# Altium schematic sheet PDU.SchDoc
size 279 x 215 mm; SheetNumber: 2; SheetTotal: 5
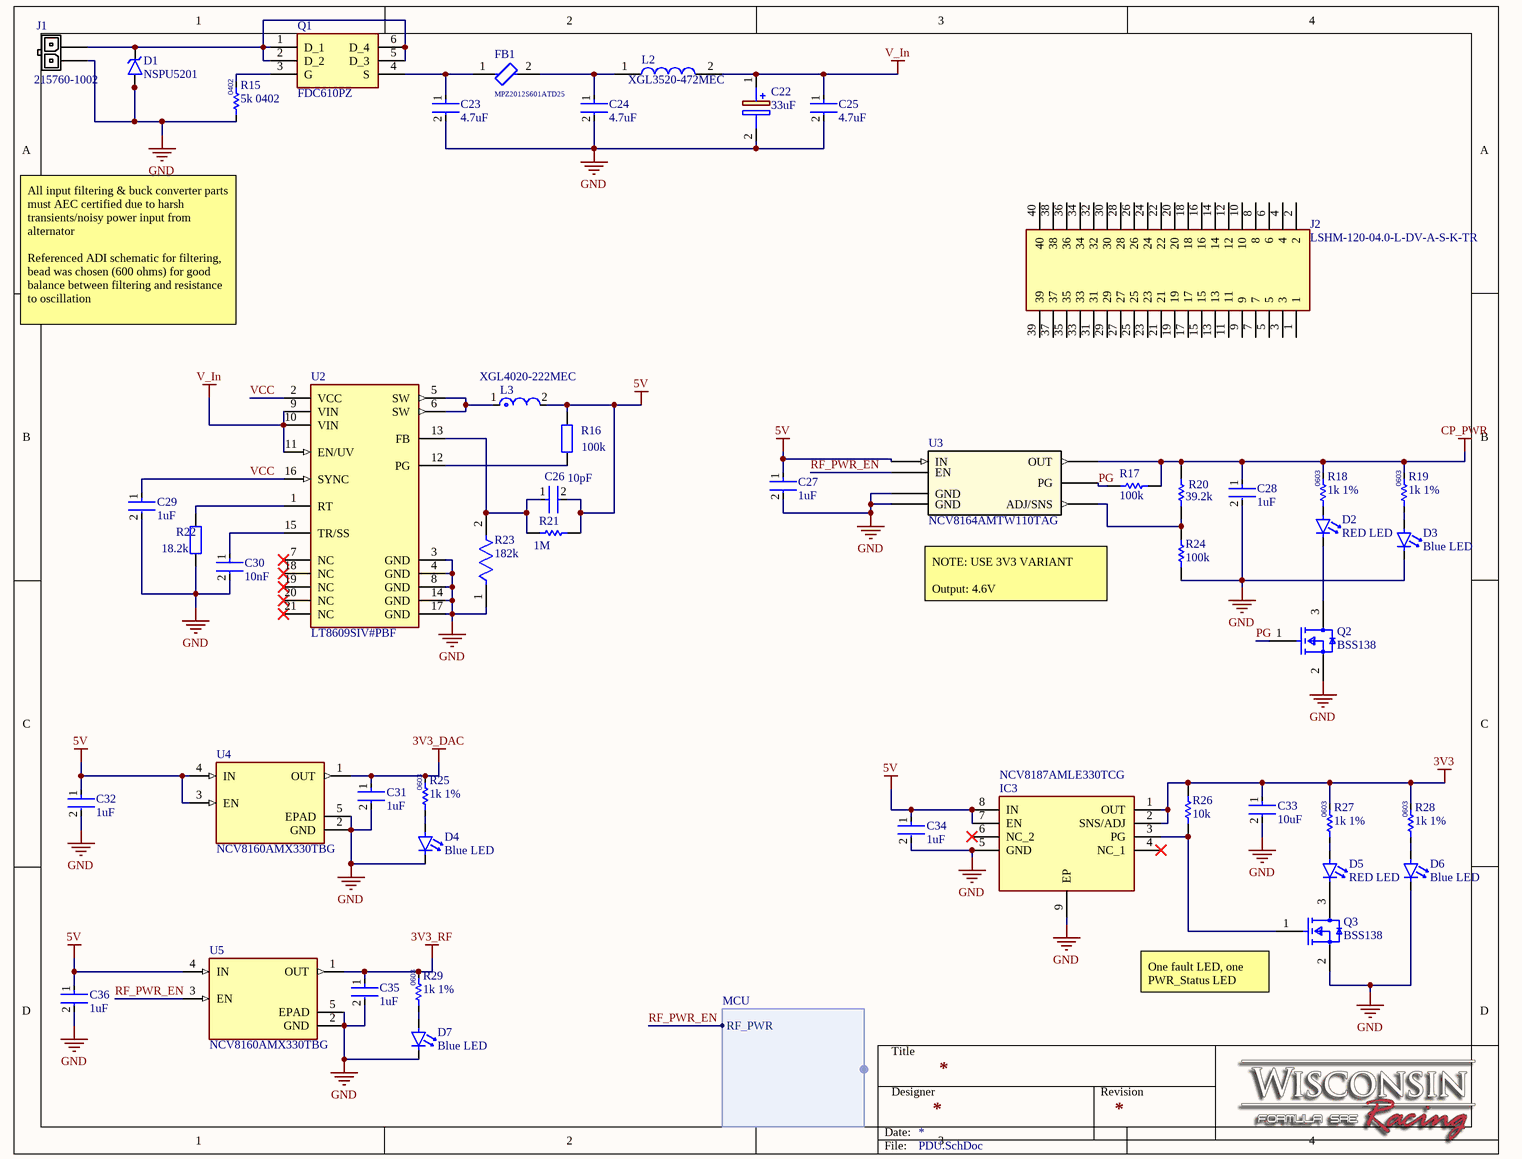
[diagram p0: PDU.SchDoc]

## Parts
C22  33uF  [MAL215097904E3]
C23  4.7uF  [FP-CGA4J-IPC_C]
C24  4.7uF  [FP-CGA4J-IPC_C]
C25  4.7uF  [FP-CGA4J-IPC_C]
C26  10pF  [FP-GCM155-0_05-IPC_C]
C27  1uF  [FP-GRM155-0_1-IPC_C]
C28  1uF  [FP-GRM155-0_1-IPC_C]
C29  1uF  [FP-GRT155-0_1-IPC_A]
C30  10nF  [FP-GCM155-0_05-IPC_C]
C31  1uF  [FP-GRM155-0_1-IPC_C]
C32  1uF  [FP-GRM155-0_1-IPC_C]
C33  10uF  [FP-GRM155-0_2-IPC_A]
C34  1uF  [FP-GRM155-0_1-IPC_C]
C35  1uF  [FP-GRM155-0_1-IPC_C]
C36  1uF  [FP-GRM155-0_1-IPC_C]
D1  NSPU5201  [NSPM5131MUTBG]
D2  RED LED  [DIOC1608X05N]
D3  Blue LED  [0603-LED-1]
D4  Blue LED  [0603-LED-1]
D5  RED LED  [DIOC1608X05N]
D6  Blue LED  [0603-LED-1]
D7  Blue LED  [0603-LED-1]
FB1  MPZ2012S601ATD25  [BEADC2012X105N]
IC3  NCV8187AMLE330TCG  [SON65P300X300X100-9N-D]
J1  215760-1002  [215760-1002-Footprint-1]
J2  LSHM-120-04.0-L-DV-A-S-K-TR  [LSHM-120-XX.X-YYY-DV-A-S-K-TR]
L2  XGL3520-472MEC  [XGL3520472MEC]
L3  XGL4020-222MEC  [FP-XGL4020-MFG]
Q1  FDC610PZ  [SOT95P280X110-6N]
Q2  BSS138  [FP-318-08-IPC_B]
Q3  BSS138  [FP-318-08-IPC_B]
R15  5k 0402  [Res0402-Type-1]
R16  100k  [WRIS-RSKS_0402]
R17  100k  [RESC1005X40X25NL05T10]
R18  1k 1%  [Res0603-type-1]
R19  1k 1%  [Res0603-type-1]
R20  39.2k  [RESC1005X40X25ML05T10]
R21  1M  [RESC1005X40X25NL05T10]
R22  18.2k  [WRIS-RSKS_0402]
R23  182k  [FP-AC0402-IPC_C]
R24  100k  [RESC1005X40X25NL05T10]
R25  1k 1%  [Res0603-type-1]
R26  10k  [RESC1005X40X25ML05T05]
R27  1k 1%  [Res0603-type-1]
R28  1k 1%  [Res0603-type-1]
R29  1k 1%  [Res0603-type-1]
U2  LT8609SIV#PBF  [FP-LQFN-16-05-08-1516-MFG]
U3  NCV8164AMTW110TAG  [WDFNW6_511DW_OSI]
U4  NCV8160AMX330TBG  [VREG_NCV8160AMX330TBG]
U5  NCV8160AMX330TBG  [VREG_NCV8160AMX330TBG]

## Harnesses
MCU: RF_PWR

## Nets
3V3: C33.1 IC3.1(OUT) IC3.2(SNS/ADJ) R26.2 R27.2 R28.2
3V3_DAC: C31.1 R25.2 U4.1(OUT)
3V3_RF: C35.1 R29.2 U5.1(OUT)
5V: C26.2 C27.1 C32.1 C34.1 C36.1 IC3.7(EN) IC3.8(IN) L3.2 R16.2 R21.2 U3.6(IN) U4.3(EN) U4.4(IN) U5.4(IN)
CP_PWR: C28.1 R17.1 R18.2 R19.2 R20.2 U3.1(OUT)
GND: C22.2(-) C23.2 C24.2 C25.2 C27.2 C28.2 C29.2 C30.2 C31.2 C32.2 C33.2 C34.2 C35.2 C36.2 D1.5(GND_(A)_1) D1.6(GND_(A)_2) D1.7(GND_(A)_3) D1.8(GND_(A)_4) D3.1(C) D4.1(C) D6.1(C) D7.1(C) IC3.5(GND) IC3.9(EP) J1.2 Q2.2(S) Q3.2(S) R15.1 R22.1 R23.1 R24.1 U2.3(GND) U2.4(GND) U2.8(GND) U2.14(GND) U2.17(GND) U3.5(GND) U3.7(GND) U4.2(GND) U4.5(EPAD) U5.2(GND) U5.5(EPAD)
V_In: C22.1(+) C25.1 L2.2 U2.9(VIN) U2.10(VIN) U2.11(EN/UV)
PG: Q2.1(G) R17.2 U3.3(PG)
RF_PWR_EN: U3.4(EN) U5.3(EN) ; harness MCU.RF_PWR
VCC: C29.1 U2.2(VCC) U2.16(SYNC)
NetC23_1: C23.1 FB1.1 Q1.4(S)
NetC24_1: C24.1 FB1.2 L2.1
NetC26_1: C26.1 R21.1 R23.2 U2.13(FB)
NetC30_1: C30.1 U2.15(TR/SS)
NetD1_1: D1.1 D1.2 J1.1 Q1.1(D_1) Q1.2(D_2) Q1.5(D_3) Q1.6(D_4)
NetD2_1: D2.1(C) Q2.3(D)
NetD3_2: D3.2(A) R19.1
NetD4_2: D4.2(A) R25.1
NetD5_1: D5.1(C) Q3.3(D)
NetD5_2: D5.2(A) R27.1
NetD6_2: D6.2(A) R28.1
NetD7_2: D7.2(A) R29.1
NetIC3_3: IC3.3(PG) Q3.1(G) R26.1
NetL3_1: L3.1 U2.5(SW) U2.6(SW)
NetQ1_3: Q1.3(G) R15.2
NetR16_1: R16.1 U2.12(PG)
NetR20_1: R20.1 R24.2 U3.2(ADJ/SNS)
NetR22_2: R22.2 U2.1(RT)

Not connected (* = marked no-connect by the designer): D2 2(A); IC3 4(NC_1)* 6(NC_2)*; J2 1 2 3 4 5 6 7 8 9 10 11 12 13 14 15 16 17 18 19 20 21 22 23 24 25 26 27 28 29 30 31 32 33 34 35 36 37 38 39 40; R18 1; U2 7(NC)* 18(NC)* 19(NC)* 20(NC)* 21(NC)*

## Notes on the sheet
- All input filtering & buck converter parts must AEC certified due to harsh transients/noisy power input from alternator
  Referenced ADI schematic for filtering, bead was chosen (600 ohms) for good balance between filtering and resistance to oscillation
- NOTE: USE 3V3 VARIANT
  Output: 4.6V
- (near Q3) One fault LED, one PWR_Status LED
- Title
- Designer
- Revision
- Date:
- File:
- (in symbol CMP-005-000017-1) 0603
- (in symbol CMP-Res-00031-1) 0402

## Library data of the parts
C22 = MAL215097904E3: Capacitor Polarised / MAL215097904E3; Manufacturer_Name: Vishay; Datasheet Link: https://www.vishay.com/docs/28395/150crz.pdf; Height: 10.5mm; Manufacturer_Part_Number: MAL215097904E3; Mouser Part Number: 594-MAL215097904E3; Mouser Price/Stock: https://www.mouser.co.uk/ProductDetail/Vishay-BC-Components/MAL215097904E3?qs=LPi%252B6n6Uj5NKbv7W8MBx6Q%3D%3D; Arrow Part Number: MAL215097904E3; Arrow Price/Stock: https://www.arrow.com/en/products/mal215097904e3/vishay?region=nac
C23-C25 = CMP-08246-000171-1: Cap Ceramic 4.7uF 50V X7R 10% Pad SMD 0805 +125°C Automotive T/R
C26 = CMP-06035-039712-1: Ceramic Capacitor for Automotive 10pF ±5% 50VDC C0G 0402 Paper T/R; Voltage Rating: 50V; Case/Package: 0402; Dielectric: C0G; Package Quantity: 10000; Ratings: AEC-Q200; Max Operating Temperature: 125°C; Width: 0.02inch; REACH SVHC: No SVHC; Mount: Surface Mount; Min Operating Temperature: -55°C; Lead Free: Lead Free; Packaging: Tape and Reel; Capacitance: 10pF; Case Code (Imperial): 0402; Tolerance: 5%; Height: 0.5mm; Thickness: 0.022inch; Length: 0.039inch; Case Code (Metric): 1005; Weight: 0.000212oz; Voltage Rating (DC): 50V; Termination: SMD/SMT
C27 C28 C31 C32 C34-C36 = CMP-06035-028020-1: Chip Multilayer Ceramic Capacitors for General Purpose, 0402, 1.0uF, X7R, 15%, 10%, 10V / GRM155Z71A105KE01D
C29 = CMP-06035-047663-1: Multi-Layer Ceramic Capacitor 1uF 25V X6S ±10% 0402 Paper T/R / GRT155C81E105KE13D
C30 = CMP-2008-03723-3: Ceramic Capacitor for Automotive 10nF ±10% 50VDC X7R 0402 Paper T/R / GCM155R71H103KA55D; Voltage Rating (DC): 50V; Min Operating Temperature: -55°C; Radiation Hardening: No; Mount: Surface Mount; Thickness: 0.022inch; Package Quantity: 1; Case Code (Imperial): 0402; Lead Free: Lead Free; Case/Package: 0402; Depth: 0.5mm; Termination: SMD/SMT; Tolerance: 10%; Voltage: 50V; Packaging: Tape and Reel; Width: 0.02inch; REACH SVHC: No SVHC; Height: 0.5mm; Max Operating Temperature: 125°C; Case Code (Metric): 1005; Voltage Rating: 50V; Capacitance: 10nF; Ratings: AEC-Q200; Length: 1mm; Dielectric: X7R
C33 = CMP-06035-061139-1: Chip Multilayer Ceramic Capacitors for General Purpose, 0402, 10uF, X5R, 15%, 20%, 6.3V
D1 = CMP-004-000061-2: Unidirectional High Voltage ESD and Surge Protection; Provides ESD Protection to IEC6100042 Level 4: +/-30 kV Contact Discharge; Small Package: 1.8 mm x 2.0 mm; These Devices are PbFree; Manufacturer_Name: onsemi; Arrow Part Number: NSPU5201MUTBG; Design Item ID: NSPU5201MUTBG; Source: SamacSys.SchLib; Mouser Price/Stock: https://www.mouser.co.uk/ProductDetail/ON-Semiconductor/NSPU5201MUTBG?qs=byeeYqUIh0OtIrNH4%2Fsnzg%3D%3D; Mouser Part Number: 863-NSPU5201MUTBG; Height: 0mm; Datasheet Link: https://www.onsemi.com/pub/Collateral/NSPU5201-D.PDF; Manufacturer_Part_Number: NSPU5201MUTBG; Arrow Price/Stock: https://www.arrow.com/en/products/nspu5201mutbg/on-semiconductor
D2 D5 = CMP-221-0013-1: 0603 Red SMD Led; Datasheet: https://www.aopled.com/AOP_PDFs/L196L-LIC.pdf
D3 D4 D6 D7 = CMP-LED-0000-10: Single Color LED, Blue, Water Clear, 1.1mm; Lens Color: Colorless; Wavelength: 468nm; Luminous Intensity: 180mcd; Number of Elements: 1; Power Dissipation: 76mW; Max Power Dissipation: 75mW; Forward Current: 20mA; Forward Voltage: 3.8V; Lens Style: Diffused,Colorless,Clear,Rectangular; Dominant Wavelength: 475nm; Viewing Angle: 130°; Reverse Voltage: 5V; Length: 0.8mm; Max Operating Temperature: 80°C; Height: 0.55mm; Mount: Surface Mount; Number of Pins: 2; Lens Transparency: Clear; Color: Blue; Radiation Hardening: No; Illumination Color: Blue; Depth: 1.6mm; Packaging: Tape and Reel; Case Code (Imperial): 0603; Number of LEDs: 1; Lead Free: Lead Free; Case Code (Metric): 1608; Width: 0.8mm; Min Operating Temperature: -20°C; Case/Package: 0603; Package Quantity: 1; Test Current: 20mA
FB1 = CMP-002-000016-2: Ferrite Beads Multi-Layer Power 600Ohm 25% 100MHz 2A 100mOhm DCR 0805 Automotive T/R; Manufacturer_Name: TDK; Arrow Part Number: MPZ2012S601ATD25; Datasheet Link: https://product.tdk.com/system/files/dam/doc/product/emc/emc/beads/catalog/beads_automotive_power_mpz2012_en.pdf; Manufacturer_Part_Number: MPZ2012S601ATD25; Design Item ID: MPZ2012S601ATD25; Height: 1.05mm; Mouser Price/Stock: https://www.mouser.co.uk/ProductDetail/TDK/MPZ2012S601ATD25?qs=n0%2F4YYxsltT7vo9AjVUU7w%3D%3D; Mouser Part Number: 810-MPZ2012S601ATD25; Source: SamacSys.SchLib; Arrow Price/Stock: https://www.arrow.com/en/products/mpz2012s601atd25/tdk.html?utm_currency=USD&region=europe
IC3 = NCV8187AMLE330TCG: Integrated Circuit; Manufacturer_Name: onsemi; Datasheet Link: https://www.onsemi.com/pub/Collateral/NCV8187-D.PDF; Height: 1mm; Manufacturer_Part_Number: NCV8187AMLE330TCG; Mouser Part Number: 863-CV8187AMLE330TCG; Mouser Price/Stock: https://www.mouser.co.uk/ProductDetail/onsemi/NCV8187AMLE330TCG?qs=HBWAp0VN4RhK8HbhfCLXcQ%3D%3D; Arrow Part Number: NCV8187AMLE330TCG; Arrow Price/Stock: https://www.arrow.com/en/products/ncv8187amle330tcg/on-semiconductor?region=nac
J1 = CMP-007-000050-6: Micro-Fit+ Right-Angle Header, 3.00mm Pitch, Single Row, 2 Circuits, Matte Tin (Sn) Plating, UL 94V-0, Glow-Wire Capable, Black; Manufacturer 1: Molex; Number of Contacts: 2; Manufacturer Part Number 1: 215760-1002; Number of Rows: 1
J2 = LSHM-120-04.0-L-DV-A-S-K-TR: Connector; Manufacturer_Name: SAMTEC; Datasheet Link: http://suddendocs.samtec.com/prints/lshm-1xx-xx.x-xxx-dv-a-x-x-xx-mkt.pdf; Manufacturer_Part_Number: LSHM-120-04.0-L-DV-A-S-K-TR; Mouser Part Number: 200-LSHM12004LDVASK; Mouser Price/Stock: https://www.mouser.co.uk/ProductDetail/Samtec/LSHM-120-040-L-DV-A-S-K-TR?qs=PB6%2FjmICvI1v5WBlLc04lg%3D%3D; Arrow Part Number: LSHM-120-04.0-L-DV-A-S-K-TR; Arrow Price/Stock: https://www.arrow.com/en/products/lshm-120-04.0-l-dv-a-sktr/samtec?region=nac
L2 = XGL3520-472MEC: Inductor; Manufacturer_Name: COILCRAFT; Datasheet Link: https://www.coilcraft.com/getmedia/d18b8771-c466-42ab-98b9-5b7a3721ea57/xgl3520.pdf?srsltid=AfmBOoq9-uDh3EmdFKVY7cd9_AL22AmMmwAAQ9UBadXdflM2b3sgRKIR; Height: 2mm; Manufacturer_Part_Number: XGL3520-472MEC
L3 = CMP-11268-000045-2: Shielded Power Inductors
Q1 = FDC610PZ: MOSFET (P-Channel); Manufacturer_Name: onsemi; Datasheet Link: https://www.onsemi.com/pub/Collateral/FDC610PZ-D.PDF; Height: 1.1mm; Manufacturer_Part_Number: FDC610PZ; Mouser Part Number: 512-FDC610PZ; Mouser Price/Stock: https://www.mouser.co.uk/ProductDetail/onsemi-Fairchild/FDC610PZ?qs=6olcXJbp99R1vIAdhgXLVw%3D%3D; Arrow Part Number: FDC610PZ; Arrow Price/Stock: https://www.arrow.com/en/products/fdc610pz/on-semiconductor
Q2 Q3 = CMP-07173-000101-1: MOSFET N-CH 50V 220MA SOT-23; Turn-Off Delay Time: 20ns; Element Configuration: Single; Rds On Max: 3.5R; Gate to Source Voltage (Vgs): 20V; Threshold Voltage: 1.3V; Number of Elements: 1; Power Dissipation: 360mW; Rise Time: 9ns; Turn-On Delay Time: 2.5ns; Input Capacitance: 27pF; On-State Resistance: 6R; Lead Free: Lead Free; Length: 2.92mm; Width: 1.3mm; Drain to Source Breakdown Voltage: 50V; Min Operating Temperature: -55°C; REACH SVHC: No SVHC; Packaging: Tape and Reel; Radiation Hardening: No; Height: 0.93mm; Drain to Source Voltage (Vdss): 50V; Current Rating: 220mA; Voltage Rating (DC): 50V; Weight: 0.03g; Continuous Drain Current (ID): 220mA; Number of Pins: 3; Nominal Vgs: 1.3V; Max Power Dissipation: 360mW; Fall Time: 9ns; Drain to Source Resistance: 3.5R; Contact Plating: Tin; Case/Package: SOT-23; Package Quantity: 1; Dual Supply Voltage: 50V; Mount: Surface Mount; Termination: SMD/SMT; Max Operating Temperature: 150°C
R15 = CMP-Res-00031-1: Fixed Resistor, Metal Glaze/thick Film, 0.0625W, 5000ohm, 50V, 1% +/-Tol, 100ppm/Cel, Surface Mount, 0402; Power: 63mW; Resistance: 5k; Tolerance: 1%
R16 = CMP-03913-145532703-2: Resistor, 100K, 0.1W, Thick Film, 0402 Rohs Compliant: Yes; Manufacturer Lifecycle Status: ACTIVE; Resistance: 100kΩ; YEOL: 1 = Estimated lifetime > 10 years; Width: 500µm; Min Operating Temperature: -55°C; Height: 350µm; Length: 1mm; Lifecycle Status: Production; Max Operating Temperature: 155°C; RoHS: Compliant
R17 R24 = CMP-2002-07343-1: Part Number: RC0402FR-07100KL; Manufacturer: Yageo / Phycomp
R18 R19 R25 R27-R29 = CMP-005-000017-1: Fixed Resistor, Metal Glaze/thick Film, 0.1W, 1000ohm, 75V, 1% +/-Tol, 100ppm/Cel, Surface Mount, 0603; Min Operating Temperature: -55°C; Mount: Surface Mount; Packaging: Tape and Reel; Max Operating Temperature: 155°C
R20 = CMP-2002-07644-1: Part Number: RC0402FR-0739K2L; Manufacturer: Yageo
R21 = CMP-2002-07490-1: Manufacturer: Yageo / Phycomp; Part Number: RC0402FR-071ML
R22 = CMP-03913-145532814-2: Resistor, 18K2, 0.1W, Thick Film, 0402 Rohs Compliant: Yes; Manufacturer Lifecycle Status: ACTIVE; YEOL: 1 = Estimated lifetime > 10 years; Resistance: 18.2kΩ; Min Operating Temperature: -55°C; Height: 350µm; RoHS: Compliant; Lifecycle Status: Production; Width: 500µm; Length: 1mm; Max Operating Temperature: 155°C
R23 = CMP-03412-035751-2: RES 182kΩ ±1% 0.063W 0402; Max Power Dissipation: 63mW; Resistance: 182kR; Power Rating: 62.5mW; Temperature Coefficient: 100ppm/°C; Voltage Rating: 50V; Number of Terminations: 2; Tolerance: 1%; Case/Package: 0402; Min Operating Temperature: -55°C; Length: 0.039inch; Packaging: Tape and Reel; Case Code (Metric): 1005; Termination: SMD/SMT; Width: 0.5mm; RoHS Compliant: Yes; Resistor Type: Thick Film; Height: 0.015inch; Max Operating Temperature: 155°C; Series: AC; Case Code (Imperial): 0402; Weight: 2.3E-05oz; Features: Moisture Resistant
R26 = CMP-2002-00433-1: Part Number: ERJ-2GEJ103X; Manufacturer: Panasonic
U2 = CMP-09139-000009-1: IC REG BUCK ADJUSTABLE 2A 16LQFN; Manufacturer: Analog Devices; Standoff Height: 0.01mm; Nominal Supply Current: 1-1.7uA; Min Supply Voltage: 3V; Max Duty Cycle: 100%; Output Type: AdjustableProgrammable; Max Junction Temp: +125°C; Switching Frequency: 200-2200kHz; Max Supply Voltage: 42V; Number Of Outputs: 1; Digikey Description: IC REG BUCK ADJUSTABLE 2A 16LQFN; Octopart: https://octopart.com/lt8609siv%23pbf-analog+devices-88316701; Automotive: No; Package: LQFN-16-05-08-1516; Temperature Range High: +125°C; Category: IC; Temperature Range Low: -40°C; ComponentLink2Description: Datasheet; Output Current: 2A; Mouser Description: LT8609S - 42V, 2A/3A Peak Synchronous Step-Down Regulator with 2.5µA Quiescent Current; Temperature: -40°C to +125°C; ComponentLink2URL: https://www.analog.com/media/en/technical-documentation/data-sheets/LT8609S.pdf; RoHS: TRUE; Device Class L2: Power Management ICs; Device Class L3: Voltage Regulators - Switching; Height: 1.03mm; Device Class L1: Integrated Circuits (ICs); Switching Topology: Buck; Lead Free: Yes; Manufacturer Part Number: LT8609SIV#PBF
U3 = CMP-196-000000-3: LDO; Manufacturer_Name: onsemi; Source: NCV8164AMTW110TAG.SchLib; RefDes: RefDes; Design Item ID: NCV8164AMTW110TAG; Copyright: Copyright (C) 2025 Ultra Librarian. All rights reserved.; Manufacturer_Part_Number: NCV8164AMTW110TAG; Type: Power Management
U4 U5 = CMP-006-000097-1: Linear Voltage Regulator IC Positive Fixed 1 Output 250mA 4-XDFN (1x1); MF: ON Semiconductor; Design Item ID: NCV8160AMX330TBG; SnapEDA_Link: https://www.snapeda.com/parts/NCV8160AMX330TBG/Onsemi/view-part/?ref=snap; Pin Count: 5; Check_prices: https://www.snapeda.com/parts/NCV8160AMX330TBG/Onsemi/view-part/?ref=eda; Value: *; MP: NCV8160AMX330TBG; Source: NCV8160AMX330TBG.SchLib; Component Type: Standard; Package: XDFN-4 ON Semiconductor